# Altium schematic sheet UCC28600DR1_UCC28600DR.schdoc
size 127 x 101 mm
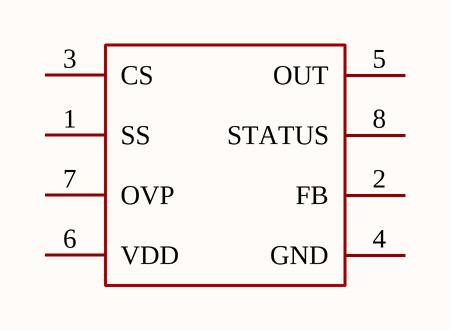
[diagram p0: UCC28600DR1_UCC28600DR.schdoc]

## Parts
U?  UCC28600DR  [SOIC-8_L5.0-W4.0-P1.27-LS6.0-BL]  (value not drawn)

## Nets

Not connected (* = marked no-connect by the designer): U? 1(SS) 2(FB) 3(CS) 4(GND) 5(OUT) 6(VDD) 7(OVP) 8(STATUS)

## Library data of the parts
U? = UCC28600DR: Manufacturer: TI(德州仪器); Add into BOM: yes; Output Isolation: 隔离; Supply Voltage: 8V~21V; Switching Frequency: 40kHz~130kHz; Duty Cycle: 99%; Topology: 反激式; Symbol: UCC28600DR; Device: UCC28600DR; LCSC Part Name: UCC28600DR; Supplier Part: C28585; Manufacturer Part: UCC28600DR; Supplier Footprint: SOIC-8; JLCPCB Part Class: Extended Part; Datasheet: https://www.ti.com/cn/lit/gpn/ucc28600; Supplier: LCSC; Convert to PCB: yes; Operating Temperature: -40℃~+105℃@(Ta)